# EAGLE design Version_2 (EAGLE 6.4)
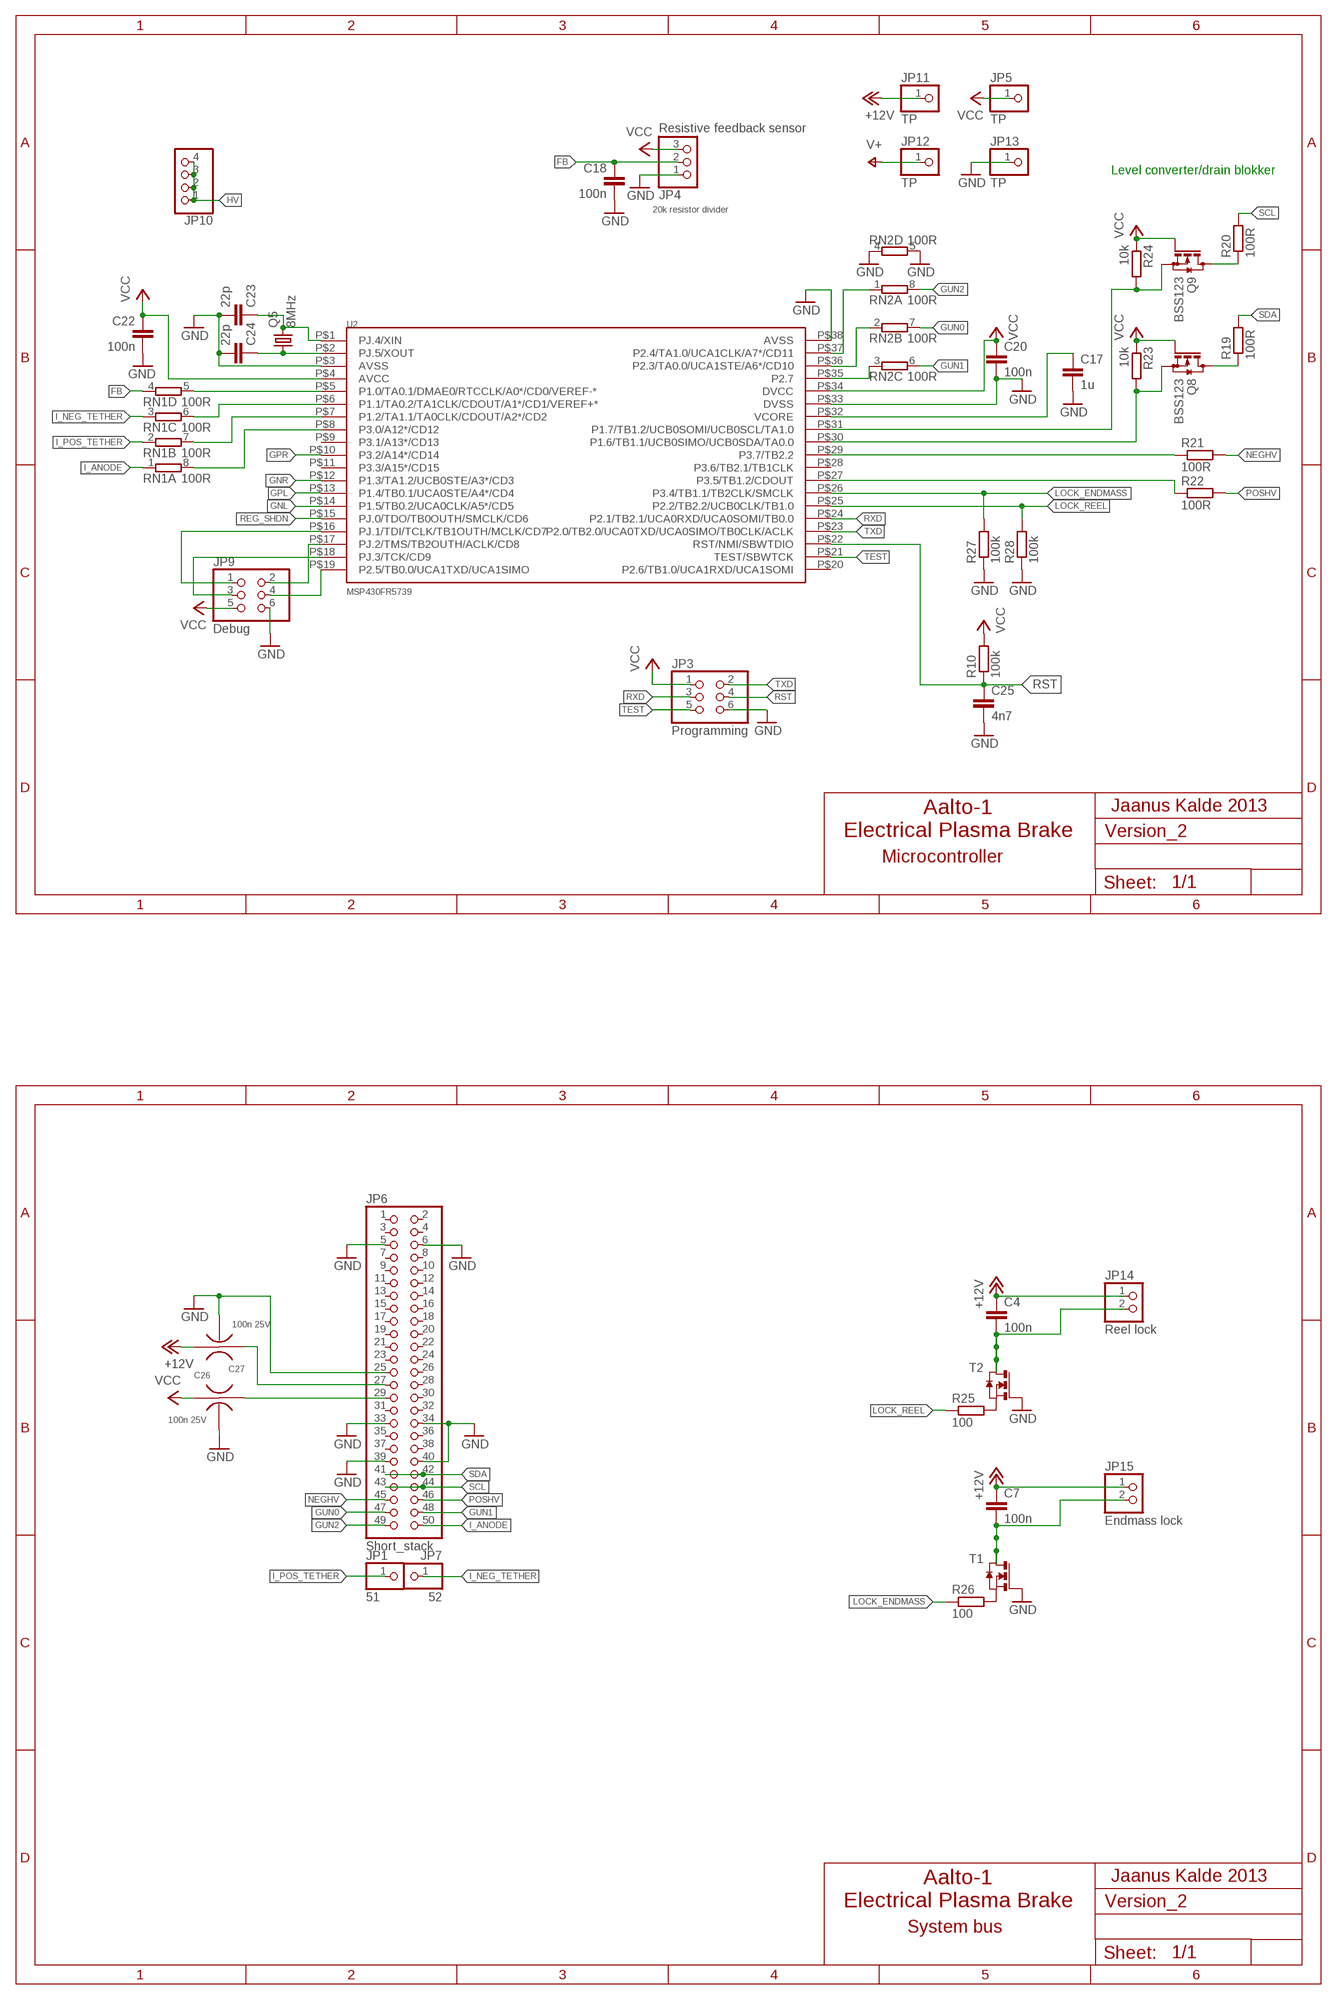
[diagram p0: schematic, sheet 1, part 1 of 2]
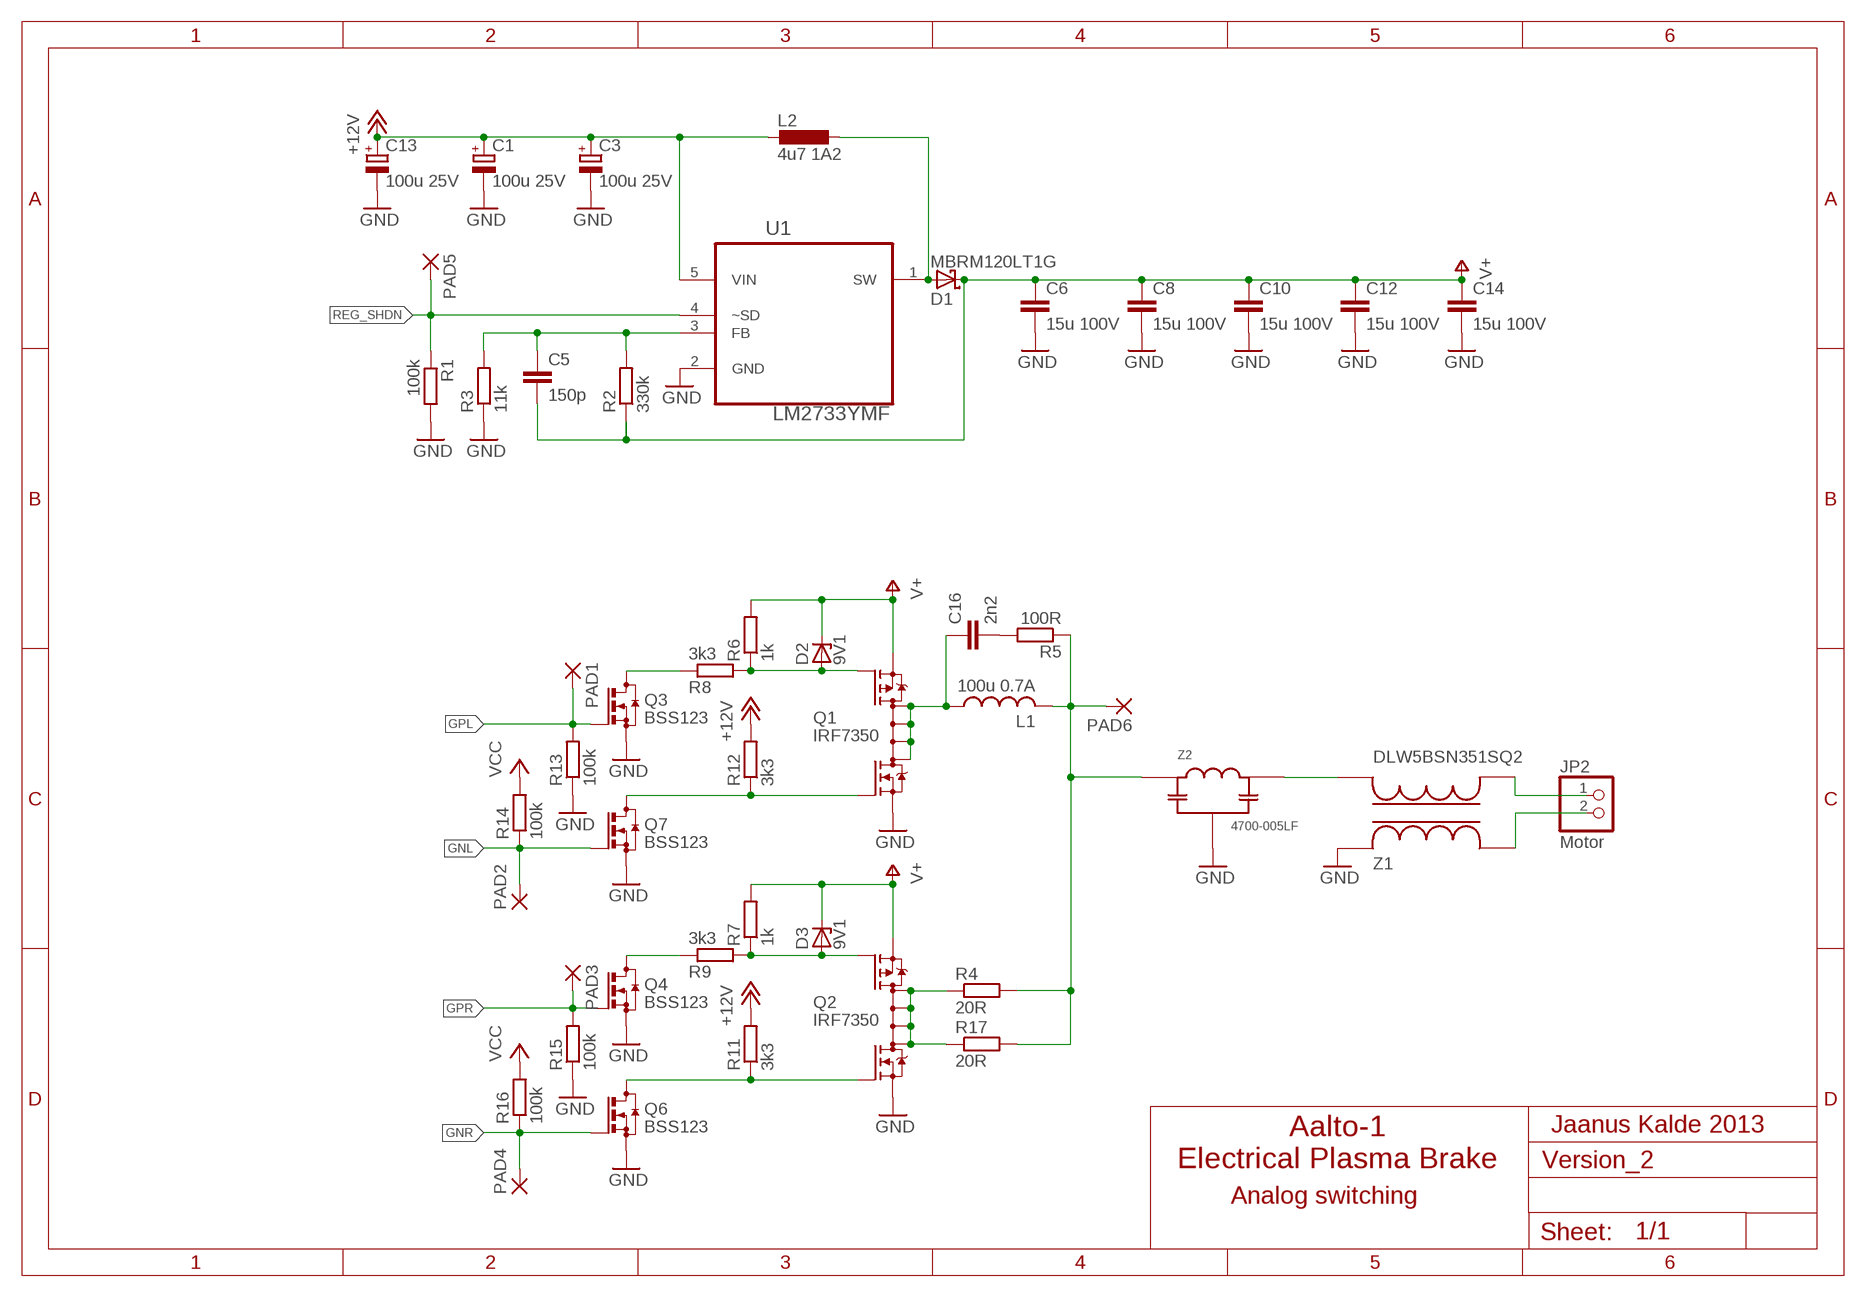
[diagram p1: schematic, sheet 1, part 2 of 2]

## Parts
C1  100u 25V  CPOL-EUSMCE  [SMC_E]
C3  100u 25V  CPOL-EUSMCE  [SMC_E]
C4  100n  C-EUC0603  [C0603]
C5  150p  C-EUC0603K  [C0603K]
C6  15u 100V  C-EUC2220K  [C2220K]
C7  100n  C-EUC0603  [C0603]
C8  15u 100V  C-EUC2220K  [C2220K]
C10  15u 100V  C-EUC2220K  [C2220K]
C12  15u 100V  C-EUC2220K  [C2220K]
C13  100u 25V  CPOL-EUSMCE  [SMC_E]
C14  15u 100V  C-EUC2220K  [C2220K]
C16  2n2  C-EUC0805  [C0805]
C17  1u  C-EUC0603K  [C0603K]
C18  100n  C-EUC0603K  [C0603K]
C20  100n  C-EUC0603K  [C0603K]
C22  100n  C-EUC0603  [C0603]
C23  22p  C-EUC0603  [C0603]
C24  22p  C-EUC0603  [C0603]
C25  4n7  C-EUC0603  [C0603]
C26  100n 25V  CAP-3TERM  [0805-3TERM]
C27  100n 25V  CAP-3TERM  [0805-3TERM]
D1  MBRM120LT1G  [POWERMITE]
D2  9V1  ZENER-DIODESOD80C  [SOD80C]
D3  9V1  ZENER-DIODESOD80C  [SOD80C]
JP1  51  PINHD-1X1  [1X01]
JP2  Motor  PINHD-1X02_2.00  [1X02M]
JP3  Programming  PINHD-2X03_MICROMATCH  [MICROMATCH-6]
JP4  Resistive feedback sensor  PINHD-1X03_2.00  [1X03M]
JP5  TP  PINHD-1X1  [1X01]
JP6  Short_stack  PINHD-2X25  [2X25]
JP7  52  PINHD-1X1  [1X01]
JP9  Debug  PINHD-2X03_MICROMATCH  [MICROMATCH-6]
JP10  PINHD-1X4  [1X04]
JP11  TP  PINHD-1X1  [1X01]
JP12  TP  PINHD-1X1  [1X01]
JP13  TP  PINHD-1X1  [1X01]
JP14  Reel lock  PINHD-1X02_2.00  [1X02M]
JP15  Endmass lock  PINHD-1X02_2.00  [1X02M]
L1  100u 0.7A  L-SMD-7.3  [L-SMD-7.3]
L2  4u7 1A2  SRR4011  [SRR4011]
PAD1  WIREPAD1,6/0,8  [1,6/0,8]
PAD2  WIREPAD1,6/0,8  [1,6/0,8]
PAD3  WIREPAD1,6/0,8  [1,6/0,8]
PAD4  WIREPAD1,6/0,8  [1,6/0,8]
PAD5  WIREPAD1,6/0,8  [1,6/0,8]
PAD6  WIREPAD1,6/0,8  [1,6/0,8]
Q1  IRF7350  IRF7389  [SO08-IRF]
Q2  IRF7350  IRF7389  [SO08-IRF]
Q3  BSS123  [SOT23]
Q4  BSS123  [SOT23]
Q5  8MHz  CRYSTALHC49UV  [HC49U-V]
Q6  BSS123  [SOT23]
Q7  BSS123  [SOT23]
Q8  BSS123  [SOT23]
Q9  BSS123  [SOT23]
R1  100k  R-EU_R0603  [R0603]
R2  330k  R-EU_R0603  [R0603]
R3  11k  R-EU_R0603  [R0603]
R4  20R  R-EU_R2512  [R2512]
R5  100R  R-EU_R0805  [R0805]
R6  1k  R-EU_R0805  [R0805]
R7  1k  R-EU_R0805  [R0805]
R8  3k3  R-EU_R0805  [R0805]
R9  3k3  R-EU_R0805  [R0805]
R10  100k  R-EU_R0603  [R0603]
R11  3k3  R-EU_R0805  [R0805]
R12  3k3  R-EU_R0805  [R0805]
R13  100k  R-EU_R0603  [R0603]
R14  100k  R-EU_R0603  [R0603]
R15  100k  R-EU_R0603  [R0603]
R16  100k  R-EU_R0603  [R0603]
R17  20R  R-EU_R2512  [R2512]
R19  100R  R-EU_R0603  [R0603]
R20  100R  R-EU_R0603  [R0603]
R21  100R  R-EU_R0603  [R0603]
R22  100R  R-EU_R0603  [R0603]
R23  10k  R-EU_R0603  [R0603]
R24  10k  R-EU_R0603  [R0603]
R25  100  R-EU_R0603  [R0603]
R26  100  R-EU_R0603  [R0603]
R27  100k  R-EU_R0603  [R0603]
R28  100k  R-EU_R0603  [R0603]
RN1  100R  4R-NEXBN8V  [EXBN8V]
RN2  100R  4R-NEXBN8V  [EXBN8V]
T1  NMOSSOT23-6  [SOT23-6]
T2  NMOSSOT23-6  [SOT23-6]
U1  LM2733YMF  [SOT95P284X119-5N]
U2  MSP430FR5739  [TSSOP38]
Z1  DLW5BSN351SQ2  DLW5BS  [DLW5BS]
Z2  4700-005LF  FILTER-PI  [FILTER-PI]

## Nets
+12V: C1.+ C3.+ C4.1 C7.1 C13.+ C26.P$1 JP11.1 JP14.1 JP15.1 L2.P$1 R11.2 R12.2 U1.5(VIN)
CLK: JP9.3 U2.P$18(PJ.3/TCK/CD9)
FB: C18.1 JP4.2 RN1.4
FBBBBBA: C5.1 R2.2 R3.2 U1.3(FB)
GND: C1.- C3.- C6.2 C8.2 C10.2 C12.2 C13.- C14.2 C17.2 C18.2 C20.2 C22.2 C23.2 C24.2 C25.2 C26.P$2 C27.P$2 JP3.6 JP4.1 JP6.5 JP6.6 JP6.25 JP6.33 JP6.34 JP6.39 JP6.40 JP9.6 JP13.1 Q1.1(N-S) Q2.1(N-S) Q3.2(S) Q4.2(S) Q6.2(S) Q7.2(S) R1.2 R3.1 R13.1 R15.1 R27.1 R28.1 RN2.4 RN2.5 T1.4(G) T2.4(G) U1.2(GND) U2.P$3(AVSS) U2.P$33(DVSS) U2.P$38(AVSS) Z1.P$2 Z2.P$2
GNL: PAD2.1(P) Q7.1(G) R14.1 U2.P$14(P1.5/TB0.2/UCA0CLK/A5*/CD5)
GNR: PAD4.1(P) Q6.1(G) R16.1 U2.P$12(P1.3/TA1.2/UCB0STE/A3*/CD3)
GPL: PAD1.1(P) Q3.1(G) R13.2 U2.P$13(P1.4/TB0.1/UCA0STE/A4*/CD4)
GPR: PAD3.1(P) Q4.1(G) R15.2 U2.P$10(P3.2/A14*/CD14)
GUN0: JP6.47 RN2.7
GUN1: JP6.48 RN2.6
GUN2: JP6.49 RN2.8
HV: JP10.1 JP10.2 JP10.3 JP10.4
I_ANODE: JP6.50 RN1.1
I_NEG_TETHER: JP7.1 RN1.3
I_POS_TETHER: JP1.1 RN1.2
LOCK_ENDMASS: R26.1 R27.2 U2.P$26(P3.4/TB1.1/TB2CLK/SMCLK)
LOCK_REEL: R25.1 R28.2 U2.P$25(P2.2/TB2.2/UCB0CLK/TB1.0)
MISO/RX: JP9.2 U2.P$17(PJ.2/TMS/TB2OUTH/ACLK/CD8)
N$1: Q2.2(N-G) Q6.3(D) R11.1
N$2: C7.2 JP15.2 T1.1(D) T1.2(D1) T1.5(D2) T1.6(D3)
N$3: R26.2 T1.3(S)
N$4: C17.1 U2.P$32(VCORE)
N$5: RN1.5 U2.P$5(P1.0/TA0.1/DMAE0/RTCCLK/A0*/CD0/VEREF-*)
N$6: Q1.2(N-G) Q7.3(D) R12.1
N$7: C26.P$3 JP6.27
N$8: D1.2(A) L2.P$2 U1.1(SW)
N$9: C4.2 JP14.2 T2.1(D) T2.2(D1) T2.5(D2) T2.6(D3)
N$10: R25.2 T2.3(S)
N$11: Q9.3(D) R20.1
N$12: Q8.3(D) R19.1
N$14: C16.2 R5.2
N$15: C16.1 L1.P$1 Q1.5(D) Q1.6(D) Q1.7(D) Q1.8(D)
N$16: L1.P$2 PAD6.1(P) R4.2 R5.1 R17.2 Z2.P$1
N$17: Q2.5(D) Q2.6(D) Q2.7(D) Q2.8(D) R4.1 R17.1
N$18: C27.P$1 JP6.29
N$19: Q9.2(S) R24.2 U2.P$31(P1.7/TB1.2/UCB0SOMI/UCB0SCL/TA1.0)
N$20: D2.A Q1.4(P-G) R6.1 R8.2
N$21: Z1.P$3 Z2.P$3
N$22: D3.A Q2.4(P-G) R7.1 R9.2
N$23: JP2.1 Z1.P$4
N$24: Q3.3(D) R8.1
N$25: Q4.3(D) R9.1
N$27: R22.1 U2.P$27(P3.5/TB1.2/CDOUT)
N$28: C23.1 Q5.2 U2.P$1(PJ.4/XIN)
N$29: C24.1 Q5.1 U2.P$2(PJ.5/XOUT)
N$30: RN1.6 U2.P$6(P1.1/TA0.2/TA1CLK/CDOUT/A1*/CD1/VEREF+*)
N$31: RN2.1 U2.P$37(P2.4/TA1.0/UCA1CLK/A7*/CD11)
N$32: R21.1 U2.P$29(P3.7/TB2.2)
N$33: Q8.2(S) R23.2 U2.P$30(P1.6/TB1.1/UCB0SIMO/UCB0SDA/TA0.0)
N$34: RN1.7 U2.P$7(P1.2/TA1.1/TA0CLK/CDOUT/A2*/CD2)
N$35: JP2.2 Z1.P$1
N$36: RN1.8 U2.P$8(P3.0/A12*/CD12)
N$38: RN2.2 U2.P$36(P2.3/TA0.0/UCA1STE/A6*/CD10)
N$39: RN2.3 U2.P$35(P2.7)
N$41: JP9.1 U2.P$16(PJ.1/TDI/TCLK/TB1OUTH/MCLK/CD7)
NEGHV: JP6.45 R21.2
POSHV: JP6.46 R22.2
REG_SHDN: PAD5.1(P) R1.1 U1.4(~SD) U2.P$15(PJ.0/TDO/TB0OUTH/SMCLK/CD6)
RST: C25.1 JP3.4 R10.1 U2.P$22(RST/NMI/SBWTDIO)
RXD: JP3.3 U2.P$24(P2.1/TB2.1/UCA0RXD/UCA0SOMI/TB0.0)
SCL: JP6.43 JP6.44 R20.2
SDA: JP6.41 JP6.42 R19.2
SLAVE: JP9.4 U2.P$19(P2.5/TB0.0/UCA1TXD/UCA1SIMO)
TEST: JP3.5 U2.P$21(TEST/SBWTCK)
TXD: JP3.2 U2.P$23(P2.0/TB2.0/UCA0TXD/UCA0SIMO/TB0CLK/ACLK)
V+: C5.2 C6.1 C8.1 C10.1 C12.1 C14.1 D1.1(C) D2.C D3.C JP12.1 Q1.3(P-S) Q2.3(P-S) R2.1 R6.2 R7.2
VCC: C20.1 C22.1 C27.P$3 JP3.1 JP4.3 JP5.1 JP9.5 Q8.1(G) Q9.1(G) R10.2 R14.2 R16.2 R23.1 R24.1 U2.P$4(AVCC) U2.P$34(DVCC)
Unconnected: JP6.1 JP6.2 JP6.3 JP6.4 JP6.7 JP6.8 JP6.9 JP6.10 JP6.11 JP6.12 JP6.13 JP6.14 JP6.15 JP6.16 JP6.17 JP6.18 JP6.19 JP6.20 JP6.21 JP6.22 JP6.23 JP6.24 JP6.26 JP6.28 JP6.30 JP6.31 JP6.32 JP6.35 JP6.36 JP6.37 JP6.38 U2.P$9(P3.1/A13*/CD13) U2.P$11(P3.3/A15*/CD15) U2.P$20(P2.6/TB1.0/UCA1RXD/UCA1SOMI) U2.P$28(P3.6/TB2.1/TB1CLK)

## Notes on the sheet
- Level converter/drain blokker
- 20k resistor divider
- Jaanus Kalde 2013 | Jaanus Kalde 2013
- Aalto-1
  Electrical Plasma Brake
- Aalto-1
  Electrical Plasma Brake
- Microcontroller | Analog switching
- Jaanus Kalde 2013
- Aalto-1
  Electrical Plasma Brake
- System bus

## Library data of the parts
C1 C3 C13 = rcl:CPOL-EU: POLARIZED CAPACITOR, European symbol
C4-C8 C10 C12 C14 C16-C18 C20 C22-C25 = rcl:C-EU: CAPACITOR, European symbol
C26 C27 = EC1_PL_MOTOR:CAP-3TERM
D1 = EC1_B_EPS_PARTS:MBRM120LT1G: Low capacitance Schottky diode. Recommeended in LTC3440 application.
D2 D3 = diode:ZENER-DIODE: Z-Diode
JP1 JP5 JP7 JP11-JP13 = pinhead:PINHD-1X1: PIN HEADER
JP2 JP14 JP15 = pinhead:PINHD-1X02: PIN HEADER
JP3 JP9 = pinhead:PINHD-2X03: PIN HEADER
JP4 = pinhead:PINHD-1X03: PIN HEADER
JP6 = pinhead:PINHD-2X25: PIN HEADER
JP10 = pinhead:PINHD-1X4: PIN HEADER
L1 = EC1_B_EPS_PARTS:L-SMD-7.3
L2 = EC1_PL_MOTOR:SRR4011
PAD1-PAD6 = wirepad:WIREPAD: Wire PAD connect wire on PCB
Q1 Q2 = transistor-fet:IRF7389: Complimentary Half Bridge HEXFET Power MOSFET Source: http://www.irf.com/product-info/datasheets/data/irf7389.pdf
Q3 Q4 Q6-Q9 = transistor-small-signal:BSS123: N-CHANNEL MOS FET
Q5 = SparkFun:CRYSTAL: Crystals Various standard crystals. Proven footprints. Spark Fun Electronics SKU : COM-00534
R1-R17 R19-R28 = rcl:R-EU_: RESISTOR, European symbol
RN1 RN2 = resistor-dil:4R-N: Array Chip Resistor Source: RS Component / Phycomp; OC_FARNELL: unknown; OC_NEWARK: unknown
T1 T2 = zetex:NMOSSOT23-6: MOS FET; OC_FARNELL: unknown; OC_NEWARK: unknown
U1 = national-semiconductor:LM2733YMF: Boost Converters; MPN: LM2733YMF; OC_FARNELL: 8181675; OC_NEWARK: 26H4075; PACKAGE: SOT-23-5; SUPPLIER: NationalSemiconductor
U2 = EC1_PL_MOTOR:MSP430FR5739
Z1 = EC1_PL_MOTOR:DLW5BS
Z2 = EC1_PL_MOTOR:FILTER-PI

## Board
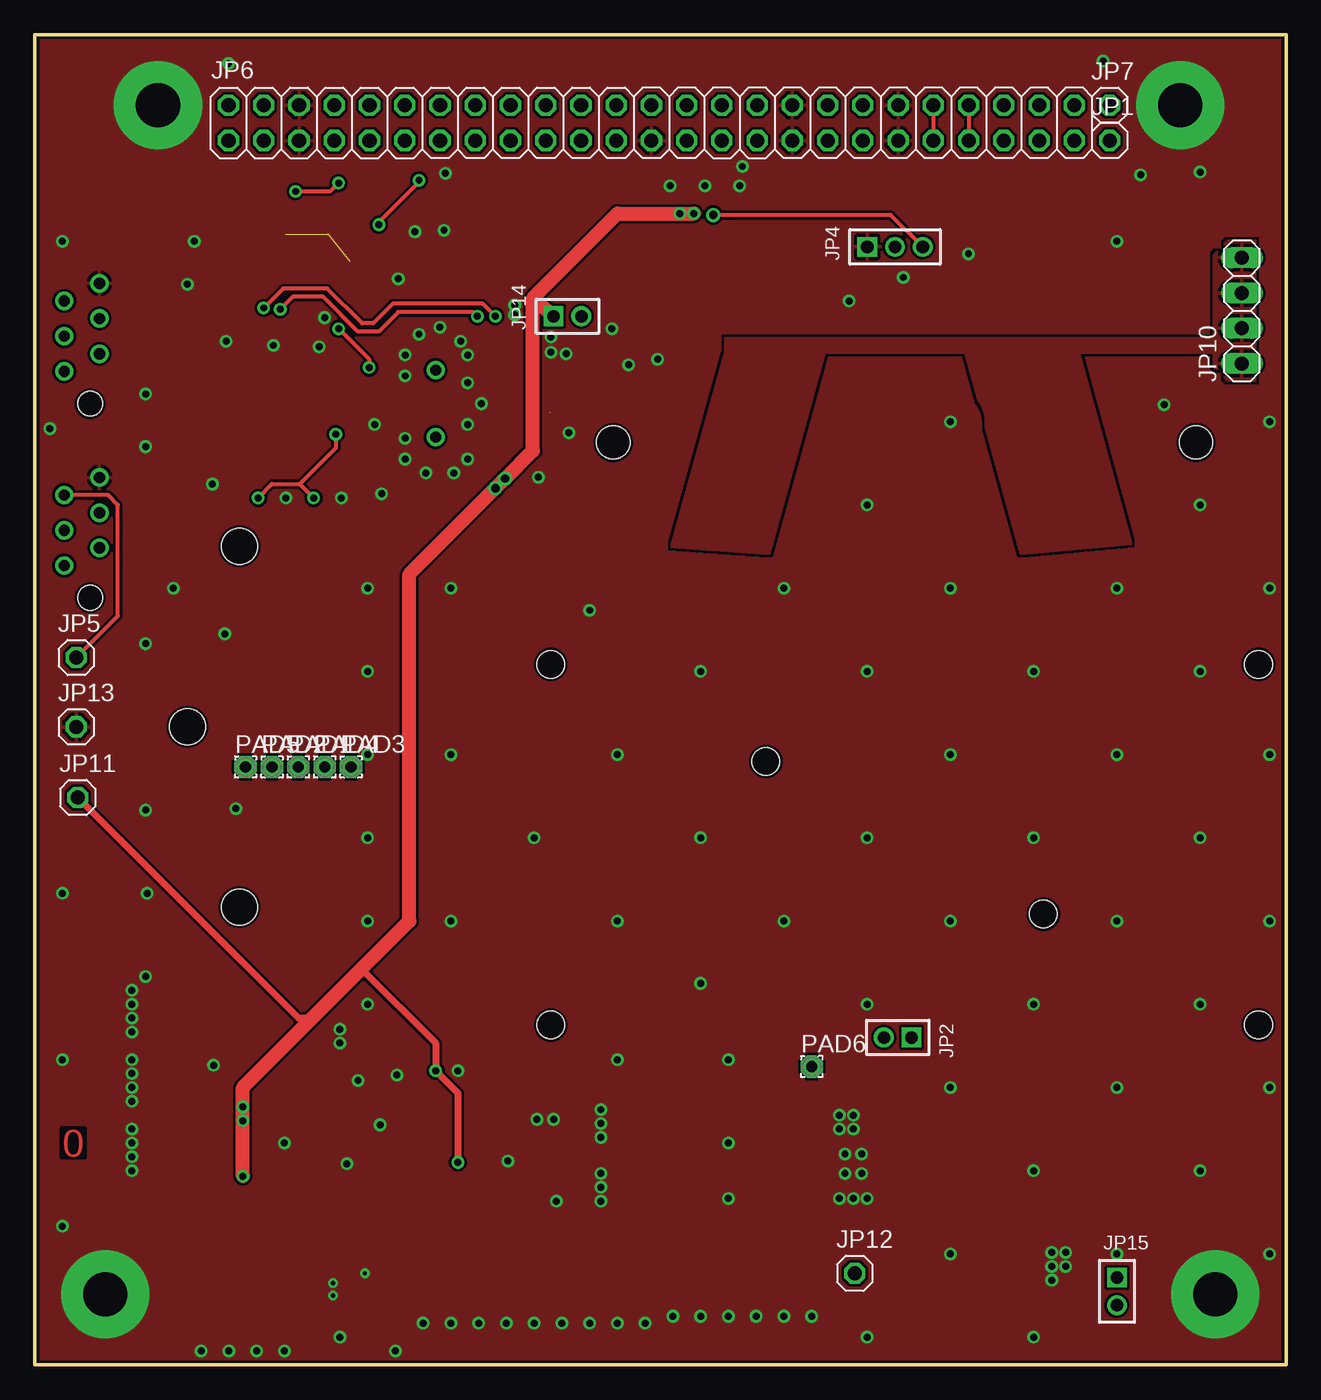
[diagram p2: board, top side]
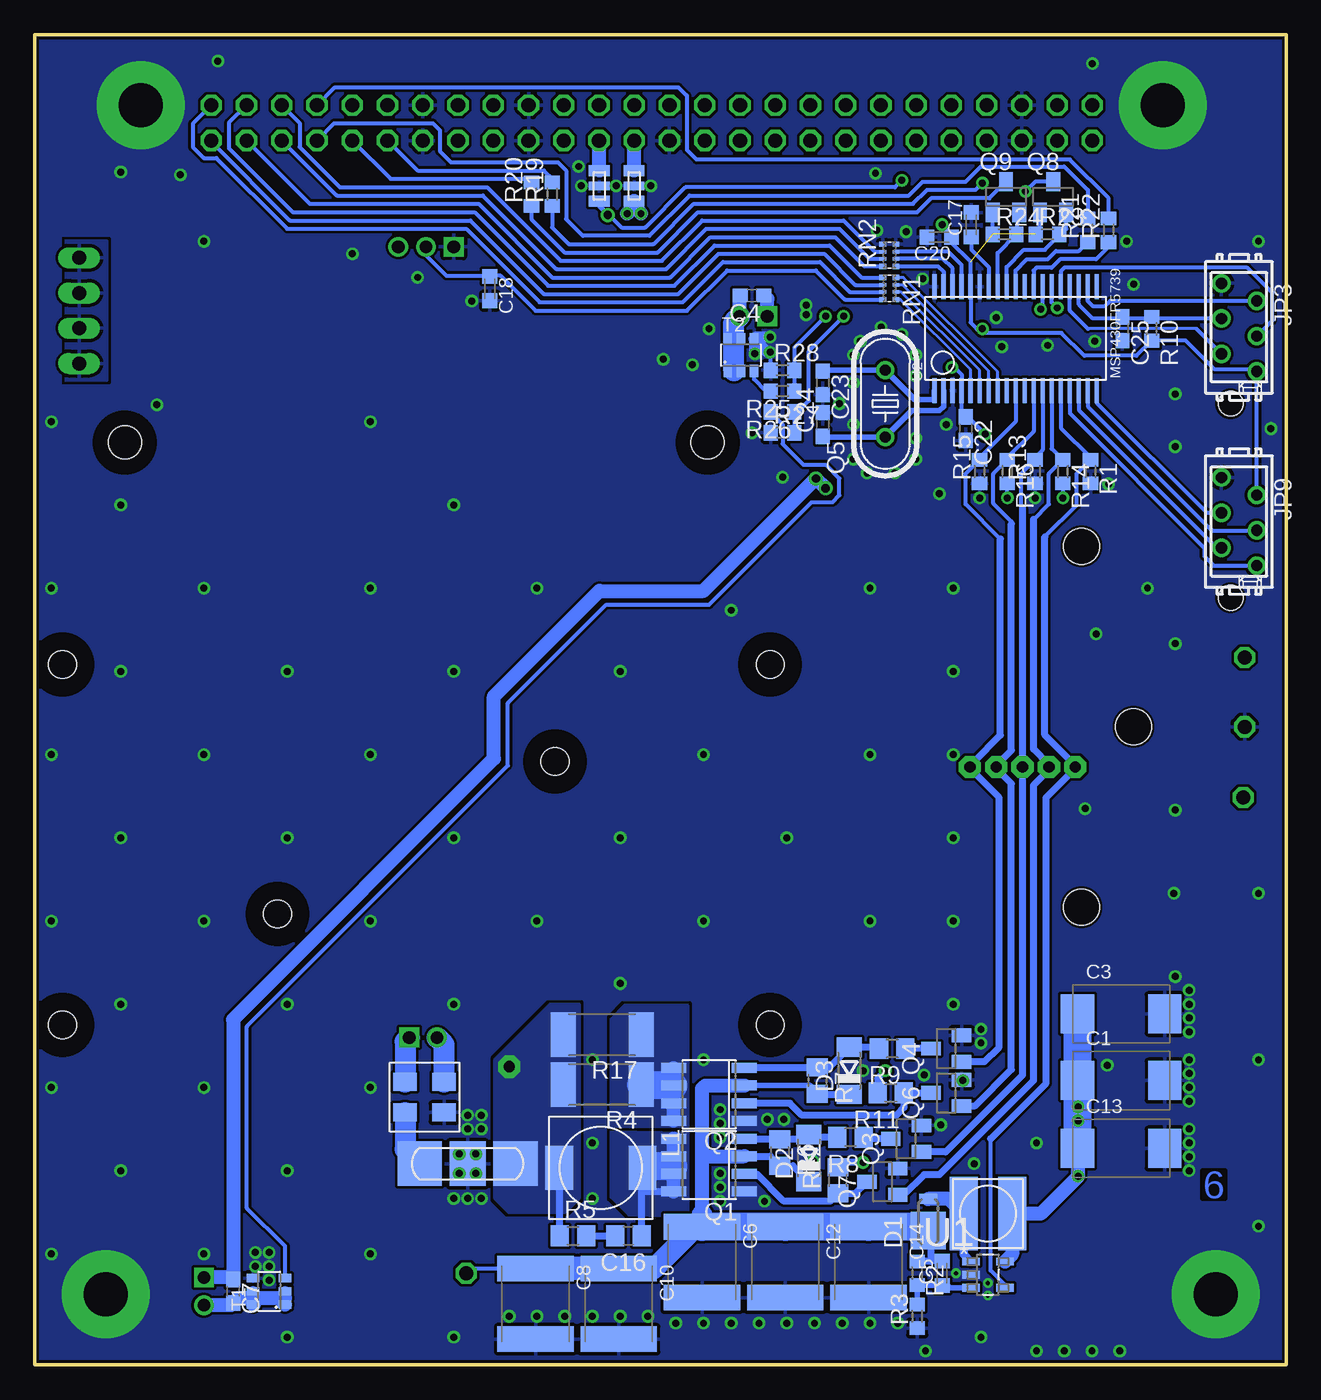
[diagram p3: board, bottom side, seen from below]

Size 90.2 x 95.9 mm. Coordinates in mm from the lower left corner, seen from the top.
Outline: 0,0 90.2,0 90.2,95.9 0,95.9 0,0
Copper layers (1*16): Top 0.035mm / dielectric 0.3mm / Bottom 0.035mm
Design rules "brandner_6layers *": minimum track width 0.05mm, minimum drill 0.1mm, track to track 0.19mm, track to pad 0.19mm, pad to pad 0.19mm, via to via 0.19mm, smd to smd 0mil, copper to edge 0.2mm, drill to drill 0.15mm, minimum pad ring 10mil, minimum via ring 8mil, stop-mask expansion 0.05mm, vias tented up to drill 0.8mm, thermal gap 10mil
Holes 1.8 mm at 4,69.3 4,55.3
Holes 2.4 mm at 83.7,66.5 41.7,66.5
Holes 2 mm at 88.2,50.5 88.2,24.5 37.2,50.5 37.2,24.5 52.7,43.5 72.7,32.5
Holes 2.6 mm at 14.75,33 11,46 14.75,59
bKeepout: area 35.2,22.5 to 39.2,26.5; area 39.7,64.5 to 43.7,68.5; area 81.7,64.5 to 85.7,68.5
bRestrict: area 35.2,22.5 to 39.2,26.5; area 35.2,48.5 to 39.2,52.5; area 50.7,41.5 to 54.7,45.5; area 70.7,30.5 to 74.7,34.5; area 86.2,22.5 to 90.2,26.5; area 86.2,48.5 to 90.2,52.5; area 81.7,64.5 to 85.7,68.5; area 39.7,64.5 to 43.7,68.5

### Footprints (pad centres in the part's own frame; a part is rotated, then mirrored left to right if it is on the bottom)
SMC_E = smd 2.4 x 2.8: + -3.15,0; - 3.15,0
C0603 = smd 1.1 x 1: 1 -0.85,0; 2 0.85,0
C0603K = smd 1.05 x 1.08: 1 -0.875,0; 2 0.875,0
C2220K = smd 1.85 x 5.5: 1 -2.55,0; 2 2.55,0
C0805 = smd 1.3 x 1.5: 1 -0.95,0; 2 0.95,0
0805-3TERM = smd 0.8 x 1.5: P$1 -1.1,0; P$3 1.1,0 | smd 0.6 x 1.5: P$2 0,0
POWERMITE = smd 2.7 x 2.5: 1 -0.635,0 | smd 0.7 x 1.3: 2 1.665,0
SOD80C = smd 1.4 x 1.8: A 1.7,0; C -1.7,0
1X01 = drill 1.016 octagon: 1 0,0
1X02M = drill 0.914 square: 1 -1,0 | drill 0.914: 2 1,0
MICROMATCH-6 = drill 0.813: 1 3.175,1.27; 2 1.905,-1.27; 3 0.635,1.27; 4 -0.635,-1.27; 5 -1.905,1.27; 6 -3.175,-1.27
1X03M = drill 0.914 square: 1 -2,0 | drill 0.914: 2 0,0; 3 2,0
2X25 = drill 1.016 octagon: 1 -30.48,-1.27; 2 -30.48,1.27; 3 -27.94,-1.27; 4 -27.94,1.27; 5 -25.4,-1.27; 6 -25.4,1.27; 7 -22.86,-1.27; 8 -22.86,1.27; 9 -20.32,-1.27; 10 -20.32,1.27; 11 -17.78,-1.27; 12 -17.78,1.27; 13 -15.24,-1.27; 14 -15.24,1.27; 15 -12.7,-1.27; 16 -12.7,1.27; 17 -10.16,-1.27; 18 -10.16,1.27; 19 -7.62,-1.27; 20 -7.62,1.27; 21 -5.08,-1.27; 22 -5.08,1.27; 23 -2.54,-1.27; 24 -2.54,1.27; 25 0,-1.27; 26 0,1.27; 27 2.54,-1.27; 28 2.54,1.27; 29 5.08,-1.27; 30 5.08,1.27; 31 7.62,-1.27; 32 7.62,1.27; 33 10.16,-1.27; 34 10.16,1.27; 35 12.7,-1.27; 36 12.7,1.27; 37 15.24,-1.27; 38 15.24,1.27; 39 17.78,-1.27; 40 17.78,1.27; 41 20.32,-1.27; 42 20.32,1.27; 43 22.86,-1.27; 44 22.86,1.27; 45 25.4,-1.27; 46 25.4,1.27; 47 27.94,-1.27; 48 27.94,1.27; 49 30.48,-1.27; 50 30.48,1.27
1X04 = drill 1.016 long: 1 -3.81,0; 2 -1.27,0; 3 1.27,0; 4 3.81,0
L-SMD-7.3 = smd 3.2 x 2: P$1 0,3; P$2 0,-3
SRR4011 = smd 2 x 5.3: P$1 -1.75,0; P$2 1.75,0
1,6/0,8 = drill 0.813 pad 1.6 octagon: 1 0,0
SO08-IRF = smd 0.72 x 1.78: 1 -1.905,-2.543; 2 -0.635,-2.543; 3 0.635,-2.543; 4 1.905,-2.543; 5 1.905,2.543; 6 0.635,2.543; 7 -0.635,2.543; 8 -1.905,2.543
SOT23 = smd 1 x 1.4: 1 -0.95,-1.1; 2 0.95,-1.1; 3 0,1.1
HC49U-V = drill 0.813: 1 -2.413,0; 2 2.413,0
R0603 = smd 1 x 1.1: 1 -0.85,0; 2 0.85,0
R2512 = smd 1.8 x 3.2: 1 -2.8,0; 2 2.8,0
R0805 = smd 1.3 x 1.5: 1 -0.95,0; 2 0.95,0
EXBN8V = smd 0.38 x 0.5: 1 -0.8,-0.475; 4 0.8,-0.475; 5 0.8,0.475; 8 -0.8,0.475 | smd 0.25 x 0.5: 2 -0.25,-0.475; 3 0.25,-0.475; 6 0.25,0.475; 7 -0.25,0.475
SOT23-6 = smd 0.6 x 0.9: 1 -0.95,-1.15; 2 0,-1.15; 3 0.95,-1.15; 4 0.95,1.15; 5 0,1.15; 6 -0.95,1.15
SOT95P284X119-5N = smd 1.27 x 0.559: 1 -1.219,0.94; 2 -1.219,0; 3 -1.219,-0.94; 4 1.219,-0.94; 5 1.219,0.94
TSSOP38 = smd 1.8 x 0.3: P$1 -3.75,5.85; P$2 -3.75,5.2; P$3 -3.75,4.55; P$4 -3.75,3.9; P$5 -3.75,3.25; P$6 -3.75,2.6; P$7 -3.75,1.95; P$8 -3.75,1.3; P$9 -3.75,0.65; P$10 -3.75,0; P$11 -3.75,-0.65; P$12 -3.75,-1.3; P$13 -3.75,-1.95; P$14 -3.75,-2.6; P$15 -3.75,-3.25; P$16 -3.75,-3.9; P$17 -3.75,-4.55; P$18 -3.75,-5.2; P$19 -3.75,-5.85; P$20 3.75,-5.85; P$21 3.75,-5.2; P$22 3.75,-4.55; P$23 3.75,-3.9; P$24 3.75,-3.25; P$25 3.75,-2.6; P$26 3.75,-1.95; P$27 3.75,-1.3; P$28 3.75,-0.65; P$29 3.75,0; P$30 3.75,0.65; P$31 3.75,1.3; P$32 3.75,1.95; P$33 3.75,2.6; P$34 3.75,3.25; P$35 3.75,3.9; P$36 3.75,4.55; P$37 3.75,5.2; P$38 3.75,5.85
DLW5BS = smd 1.3 x 1.7: P$1 -1.1,1.4; P$2 1.1,1.4; P$3 1.1,-1.4; P$4 -1.1,-1.4
FILTER-PI = smd 3.2 x 3.2: P$1 -3.45,0; P$3 3.45,0 | smd 2.6 x 3.2: P$2 0,0

### Placement (x,y rotation side)
C1  11.9,20.5 0 bottom
C3  11.9,25.3 0 bottom
C4  38.5,77.1 180 bottom
C5  24.8,6.6 90 bottom
C6  42.1,7.4 270 bottom
C7  75.9,5.3 270 bottom
C8  54.1,4.4 270 bottom
C10  48.1,4.4 270 bottom
C12  36.1,7.4 270 bottom
C13  11.9,15.6 0 bottom
C14  30.1,7.4 270 bottom
C16  47.4,9.3 180 bottom
C17  22.7,82.2 90 bottom
C18  57.4,77.6 270 bottom
C20  25,81.3 180 bottom
C22  23.1,67.5 270 bottom
C23  33.4,70.8 270 bottom
C24  33.4,67.8 90 bottom
C25  11.8,74.7 270 bottom
C26  47,85 90 bottom
C27  49.5,85 270 bottom
D1  25.8,10.3 90 bottom
D2  34.4,14.9 90 bottom
D3  31.5,21.2 90 bottom
JP1  77.47,88.27 0 top
JP2  62.2,23.6 180 top
JP3  3.4,74.8 270 bottom
JP4  62,80.6 0 top
JP5  3,51 0 top
JP6  44.45,89.54 0 top
JP7  77.47,90.81 0 top
JP9  3.4,60.8 270 bottom
JP10  87,76 90 top
JP11  3.1,40.9 0 top
JP12  59.1,6.6 0 top
JP13  3,46 0 top
JP14  38.4,75.6 0 top
JP15  78,5.3 270 top
L1  49.4,14.2 270 bottom
L2  21.5,10.9 180 bottom
PAD1  19,43.1 0 top
PAD2  17.1,43.1 0 top
PAD3  22.8,43.1 0 top
PAD4  20.9,43.1 0 top
PAD5  15.2,43.1 0 top
PAD6  56,21.5 0 top
Q1  41.6,14.4 90 bottom
Q2  41.6,19.5 90 bottom
Q3  27.4,16.3 90 bottom
Q4  24.5,22.8 90 bottom
Q5  28.9,69.3 90 bottom
Q6  24.5,19.6 90 bottom
Q7  29.1,13.2 90 bottom
Q8  16.8,84.2 0 bottom
Q9  20.2,84.2 0 bottom
R1  14.1,64.4 270 bottom
R2  26.6,6.6 270 bottom
R3  26.6,3.5 90 bottom
R4  49.3,20.2 180 bottom
R5  51.4,9.3 0 bottom
R6  36.5,15.3 270 bottom
R7  33.8,20.5 270 bottom
R8  31.4,16.4 180 bottom
R9  28.4,22.8 180 bottom
R10  9.7,74.7 270 bottom
R11  28.5,19.6 180 bottom
R12  32.3,13.3 90 bottom
R13  18.1,64.4 90 bottom
R14  16.1,64.4 270 bottom
R15  22.1,64.4 90 bottom
R16  20.1,64.4 270 bottom
R17  49.3,23.8 180 bottom
R19  52.9,84.4 90 bottom
R20  54.4,84.4 90 bottom
R21  14.3,81.8 90 bottom
R22  12.8,81.8 90 bottom
R23  17.2,81.5 0 bottom
R24  20.3,81.5 0 bottom
R25  36.3,70.2 180 bottom
R26  36.3,68.7 180 bottom
R27  36.3,67.2 0 bottom
R28  36.3,71.7 0 bottom
RN1  28.6,77.6 270 bottom
RN2  28.6,80 90 bottom
T1  73.3,5.3 90 bottom
T2  39.3,72.8 0 bottom
U1  21.5,6.5 0 bottom
U2  19.5,74 90 bottom
Z1  62.1,19.3 270 bottom
Z2  59,14.5 180 bottom

### Tracks (layer width: path | path; a pad name or v marks a point on that pad's centre or on a via)
+12V  (via drill 0.5, 0.5 pad 0.5, 0.6)
  Top 0.5: v30.5,14.6 30.5,19.6 v28.9,21.2 28.9,23.2 23.55,28.55 | JP11.1 19,25 20,25
  Top 1: 35.9,76.9 35.9,65.9 v33.9,63.9 33.85,63.85 27,57 27,32 23.55,28.55 20,25 15,20 v15,13.6 | 35.9,76.9 42,83 v47.5,83 | 35.9,76.9 JP14.1
  Bottom 0.5: R12.2 31.95,14.6 v30.5,14.6 | v28.9,21.2 29.45,20.65 R11.2
  Bottom 1: U1.5 19.75,7.97 L2.P$1 | 19.55,10.7 L2.P$1 | v15,17.6 v15,18.6 15,20.45 C1.+ | v15,17.6 v15,13.6 17.7,10.9 L2.P$1 | 47,83.5 v46.5,83 | v47.5,83 47,83.5 | 47,83.5 C26.P$1 | C13.+ 15,15.65 v15,17.6 | JP15.1 76.05,6.3 C7.1 75.9,24.9 57.1,43.7 57.1,48.2 49.5,55.8 42,55.8 v33.9,63.9 v33.2,63.2 | JP14.1 37.4,76.85 C4.1
  Bottom 2: C3.+ C13.+
CLK
  Bottom 0.3: U2.P$18 14.3,69.1 5.37,60.16 JP9.3
FB
  Bottom 0.3: JP4.2 62,80 60.52,78.53 57.45,78.53 C18.1 57.35,78.53 56.62,78.53 54.1,76 43.2,76 40.3,78.9 33.9,78.9 31.8,76.8 RN1.4
FBBBBBA
  Bottom 0.4: C5.1 24.82,5.75 R2.2
  Bottom 0.406: U1.3 24.31,5.56 | R2.2 R3.2
  Bottom 0.5: 24.31,5.56 24.48,5.72 C5.1
GND  (via drill 0.3, 0.5, 3.18 pad 6.35)  (1 unrouted)
  Bottom 0.3: R28.1 37.15,72.75 37.65,73.25
  Bottom 0.8: T2.4 38.35,72.85 v38.3,72.9 | v37.2,73 37.4,73 37.65,73.25 T2.4 | v37.2,74.1 38.2,74.1 T2.4
  other vias: 40.8,18.4 40.8,17.4 40.8,16.4 40.8,13.8 40.8,12.8 40.8,11.8 22,23.2 22,24.2 26.1,20.9 24.9,17.3 27.4,81.7 22.1,62.5 38.5,67.2 32.2,69.3 26.2,78.3 24.5,67.8 20.9,75.5 29.6,85.9 23.8,6.6 21.5,5.9 21.5,5 58,17 59,17 58,18 58,12 59,12 60,12 59,18 11,77.9 37.4,17.7 36.2,17.7 42,3 36,3 40,3 38,3 34,3 32,3 30,3 28,3 26,1 16,1 18,1 44,3 23.3,20.5 14,1 12,1 2,10 7,16 2,22 8,28 2,34 8,40 13.7,52.7 8,52 10,56 8,66.2 1.1,67.5 8,70 2,81 11.5,81 13.97,93.81 22,2 48,3.5 54,3.5 60,2 66,8 72,2 78,8 84,14 89,20 72,14 78,20 84,26 89,32 84,38 89,44 84,50 89,56 84,62 89,68 81.4,69.22 79.7,85.8 67.3,80.1 62.6,78.4 44.9,72.5 60,50 66,68 54,56 60,62 78,56 72,50 66,56 78,44 66,44 72,38 78,32 72,26 66,32 60,38 66,20 60,26 54,32 48,27.5 42,32 48,38 36,38 42,44 48,50 40,54.4 36.3,64 30,56 24,50 30,44 24,38 30,32 24,26 24,44 24,32 24,56 25,62.8 12.9,21.6 14.5,40.1 12.8,63.5 84,86 77,94 78,81 89,8 18,16 34.1,14.7 30.5,21.2 42,22 50,22 50,16 50,12 20.5,73.4 58.4,15.2 59.6,15.2 58.4,13.8 59.6,13.8 37.6,11.8 22.5,14.5 13.8,73.8 31.2,70.8 31.2,67.8 31.2,65.3 26.7,66.8 26.7,65.3 30.2,64.3 28.2,64.3 26.7,71.3 26.7,72.8 31.2,72.8 27.7,74.3 29.2,74.8 30.7,73.8 17.2,73.5 45.8,85 29.5,81.8 48.3,85 50.8,85 58.7,76.7 8.89,90.81 82.55,90.81 5.08,5.08 85.09,5.08 18.1,62.5 51,86.4 74.3,7.1 74.3,8.1 73.3,8.1 73.3,7.1 73.3,6.1 42.8,72.1 41.6,74.7 34.6,76.4 34.6,75.7 7,20 7,21 7,25 7,26 7,15 46,3.5 50,3.5 52,3.5 56,3.5 7,19 7,22 7,24 7,27 7,17 7,14 8.1,34
  pour Bottom (no thermals): 36.6,11.6 36.6,12.2 38.6,14.2 41.6,14.2 41.6,11.2 36.6,11.2
  pour Bottom (no thermals): 33.6,19.6 41.6,19.6 41.6,15.6 33.6,15.6
  pour Bottom (no thermals): 24.4,8.2 20.6,8.2 20.6,4.4 24.4,4.4
  pour Top (rank 4): 90,96 0,96 0,0 90,0
  pour Bottom (rank 4): 90,96 90,0 0,0 0,96
GNL
  Bottom 0.3: U2.P$14 16.9,66.05 R14.1 17.1,64.25 17.1,62.05 18.2,60.95
  Bottom 0.5: Q7.1 27.55,12.25 26.1,13.7 25,13.7 18.2,20.5 18.2,41.8 17.1,42.9 PAD2.1 17.1,43.2 17.1,43.3 18.2,44.4 18.2,60.95
GNR
  Bottom 0.3: U2.P$12 18.2,67.3 20.1,65.4 R16.1 21.1,64.25 21.1,62.1 19.8,60.8 19.8,60.65 | PAD4.1 20.6,43.1
  Bottom 0.5: Q6.1 22.45,18.65 19.8,21.3 19.8,41.9 20.6,42.7 20.6,43.1 20.6,43.5 19.8,44.3 19.8,60.65
GPL
  Bottom 0.3: U2.P$13 17.55,65.95 18.1,65.4 R13.2 19.1,64.25 19.1,61.9 19,61.8
  Bottom 0.5: 19,61.8 19,44.3 PAD1.1 19,20.9 24.55,15.35 Q3.1
GPR
  Bottom 0.3: U2.P$10 19.5,68 22.1,65.4 R15.2 | 22.05,65.25 R15.2 | 20.6,59.55 23.1,62.05 23.1,64.25 R15.2 | PAD3.1 22.5,43.1
  Bottom 0.5: Q4.1 21.75,21.85 20.7,22.9 20.7,40.9 22.5,42.7 22.5,43.1 22.5,43.5 20.6,45.4 20.6,59.55
GUN0
  Bottom 0.3: JP6.47 68.42,84.3 57.9,84.3 52.6,79 44.7,79 41.8,81.9 32.2,81.9 30.05,79.75 RN2.7
GUN1
  Bottom 0.3: JP6.48 71.1,89.52 71.1,87.8 68.2,84.9 57.6,84.9 52.3,79.6 45,79.6 42.1,82.5 31.9,82.5 29.65,80.25 RN2.6
GUN2
  Bottom 0.3: JP6.49 70.36,83.7 58.2,83.7 52.9,78.4 44.4,78.4 41.5,81.3 32.5,81.3 30.4,79.2 RN2.8
HV
  pour Top (isolate 2): 49.8,74 85,74 85,80 86,81 88,81 88,71 86,71 85,72 85,73 75.2,73 79,59.2 71.1,58.5 67.1,73 56.9,73 52.9,58.5 45.9,59 49.8,73
  pour Bottom (isolate 2): 85,81 88,81 88,71 85,71
I_ANODE
  Bottom 0.3: JP6.50 76.2,89.54 76.2,87.7 71.6,83.1 58.5,83.1 53.2,77.8 44.1,77.8 41.2,80.7 32.9,80.7 30.6,78.4 RN1.1
I_NEG_TETHER
  Bottom 0.3: JP7.1 78.8,89.48 78.8,87.8 78,87 77.1,87 72,81.9 59.1,81.9 53.8,76.6 43.5,76.6 40.6,79.5 33.6,79.5 31.45,77.35 RN1.3
I_POS_TETHER
  Bottom 0.3: JP1.1 77.47,88.17 71.8,82.5 58.8,82.5 53.5,77.2 43.8,77.2 40.9,80.1 33.3,80.1 31.05,77.85 RN1.2
LOCK_ENDMASS  (via drill 0.5)
  Top 0.3: v31.9,75.6 31.6,75.9 26.2,75.9 24.8,74.5 23.3,74.5 20.8,77 18.6,77 v17.7,76.1
  Bottom 0.3: v17.7,76.1 17.55,76.25 U2.P$26 | v31.9,75.6 34.4,73.1 34.4,69.5 35.2,68.7 R26.1 R27.2
LOCK_REEL  (via drill 0.5)
  Top 0.3: v33.2,75.6 32.3,76.5 25.8,76.5 24.4,75.1 23.6,75.1 21.1,77.6 17.9,77.6 v16.5,76.2
  Bottom 0.3: v16.5,76.2 16.9,76.6 U2.P$25 | v33.2,75.6 35.45,73.35 R28.2 R25.1
MISO/RX
  Bottom 0.3: U2.P$17 14.95,68.85 5,58.9 JP9.2
N$1
  Bottom 0.5: Q2.2 35.77,18.86 34.9,18 28.1,18 27.55,18.55 R11.1 Q6.3
N$2
  Bottom 0.8: T1.2 72.15,4.8 | T1.5 T1.6
  Bottom 1: 72.15,4.8 72.3,4.8 | 72.3,4.8 74.4,4.8 | 74.4,4.8 75.55,4.8 C7.2 76.05,4.3 JP15.2 | T1.1 72.3,4.5 72.3,4.8 | T1.6 74.4,4.4 74.4,4.8
N$3  (1 unrouted)
  Bottom 0.3: T1.3 72.15,8.55 74.9,11.3 74.9,24.4 56.1,43.2 56.1,47.7 49,54.8 41.6,54.8 34.2,62.2 32.7,62.2 32.2,62.7 32.2,63.9 33.2,64.9 34.8,64.9 36.3,66.4 36.3,67.8 37.15,68.65
N$4
  Bottom 0.3: C17.1 22.7,80.4 21.45,79.15 U2.P$32
N$5
  Bottom 0.2: U2.P$5 22.75,71.75 27.8,76.8 RN1.5
N$6
  Bottom 0.5: Q7.3 31.05,12.35 R12.1 32.85,11.8 36.2,11.8 38.16,13.77 Q1.2
N$7
  Bottom 1: C26.P$3 JP6.27
N$8
  Bottom 0.6: U1.1 23.25,7.97 L2.P$2
  Bottom 1: D1.2 24.32,11.96 L2.P$2
N$9
  Bottom 0.5: T2.2 39.8,71.65 T2.1 | 39.8,73.9 39.85,73.95 T2.6 T2.5
  Bottom 1: JP14.2 39.4,77.05 C4.2
  Bottom 1.5: 39.8,71.65 39.8,73.9 39.8,75.2 JP14.2
N$10
  Bottom 0.3: R25.2 37.5,70.2 38.35,71.05 T2.3
N$11
  Bottom 0.3: R20.1 54.4,82.6 52,80.2 45.3,80.2 42.4,83.1 26.6,83.1 25.6,84.1 21.4,84.1 Q9.3
N$12  (via drill 0.5)
  Top 0.3: v18.8,84.6 21.3,84.6 v21.9,85.2
  Bottom 0.3: R19.1 52.9,82 51.7,80.8 45.6,80.8 42.7,83.7 26.9,83.7 25.9,84.7 22.4,84.7 v21.9,85.2 | Q8.3 18.1,85.3 v18.8,84.6
N$14
  Bottom 0.5: R5.2 C16.2
N$15
  Bottom 0.5: C16.1 46.45,12.49 Q1.8
  Bottom 1: Q1.5 Q1.6 44.14,14.3 Q1.7 Q1.8
  Bottom 2: L1.P$1 46.3,14.3 44.14,14.3
  pour Bottom (no thermals): 43.1,16.7 48.7,16.8 48.7,12.1 47.4,10.8 43.1,10.7
N$16
  Bottom 0.5: L1.P$2 52.35,14.15 R5.1
  pour Bottom (no thermals): 51,26 51,12 52,11 56,11 57,12 57,22 53,26
N$17
  Bottom 1: Q2.8 Q2.7 Q2.6 Q2.5
  Bottom 2: R4.1 46.44,20.14 Q2.6
  pour Bottom (no thermals): 43.1,17.2 43.1,25.9 47.7,25.9 48.7,24.9 48.7,17.2
N$18
  Bottom 1: C27.P$1 49.5,88.24 JP6.29
N$19
  Bottom 0.3: Q9.2 19.35,83 R24.2 | U2.P$31 20.8,80.15 R24.2 | 19.35,81.45 R24.2
N$20
  Bottom 0.5: Q1.4 39,16.25 R6.1 34.75,16.25 D2.A 34.2,16.4 R8.2
N$21
  Bottom 1.5: Z1.P$3 63.5,15.55 Z2.P$3
N$22
  Bottom 0.5: R9.2 29.45,22.9 D3.A 32.95,21.45 R7.1 33.84,21.41 Q2.4
N$23
  Bottom 1.5: JP2.1 63.5,23.3 Z1.P$4
N$24
  Bottom 0.5: R8.1 30.35,16.3 Q3.3
N$25
  Bottom 0.5: Q4.3 R9.1
N$27
  Bottom 0.3: R22.1 12.8,80.6 13.7,79.7 16.3,79.7 16.9,79.1 18,79.1 18.2,78.9 U2.P$27
N$28
  Bottom 0.4: Q5.2 26.79,69.6 25.35,69.6 U2.P$1
  Bottom 0.406: Q5.2 33.34,71.71 C23.1
N$29
  Bottom 0.4: U2.P$2 24.7,69.1 25,68.8 26.99,68.8 Q5.1
  Bottom 0.406: Q5.1 33.34,66.89 C24.1
N$30
  Bottom 0.2: U2.P$6 22.1,71.7 27.75,77.35 RN1.6
N$31
  Bottom 0.3: RN2.1 25.1,79.2 24.7,78.8 U2.P$37
N$32
  Bottom 0.3: U2.P$29 19.5,78.9 18.7,79.7 17.2,79.7 16.6,80.3 14.95,80.3 R21.1
N$33
  Bottom 0.3: Q8.2 15.85,81.9 R23.2 16.45,81.35 17.4,80.4 18.9,80.4 20.15,79.15 U2.P$30
N$34
  Bottom 0.2: U2.P$7 21.45,71.65 27.65,77.85 RN1.7
N$35
  Bottom 1.5: Z1.P$1 60.7,23.1 JP2.2
N$36
  Bottom 0.2: U2.P$8 20.8,71.6 27.6,78.4 RN1.8
N$38
  Bottom 0.3: U2.P$36 24.05,79.05 24.75,79.75 RN2.2
N$39
  Bottom 0.3: U2.P$35 23.4,79.3 24.35,80.25 RN2.3
N$41
  Bottom 0.3: U2.P$16 15.6,68.6 5.9,58.9 5.9,58.3 5.22,57.62 JP9.1
NEGHV
  Bottom 0.3: JP6.45 68.62,89.5 61.5,89.5 61,89 61,87.5 60.2,86.7 52.5,86.7 51.9,86.1 51.9,82.6 50.7,81.4 45.9,81.4 43,84.3 27.2,84.3 26.2,85.3 23.1,85.3 22,86.4 16,86.4 14.3,84.7 R21.2
POSHV
  Bottom 0.3: JP6.46 68.56,92.1 43.8,92.1 43.2,91.5 43.2,87.6 42.5,86.9 15.6,86.9 12.8,84.1 R22.2
REG_SHDN
  Bottom 0.3: U1.4 20.28,5.78 21.3,6.8 21.3,16.3 | U2.P$15 16.25,67.55 14.1,65.4 R1.1 15.1,64.25 15.1,62 17.4,59.7 | PAD5.1 15.3,43.2 15.5,43.2
  Bottom 0.5: 21.3,16.3 17.3,20.3 17.3,40.9 15.5,42.7 15.5,43.2 15.5,43.5 17.4,45.4 17.4,59.7
RST
  Bottom 0.2: 14.9,76.4 14.95,76.45
  Bottom 0.3: JP3.4 9.7,75.44 | 9.7,75.44 11.8,75.44 | 11.8,75.44 13.94,75.44 14.9,76.4 | 14.95,76.45 U2.P$22 | 11.8,75.44 C25.1 | 9.7,75.44 R10.1
RXD
  Bottom 0.2: 16.2,78.9 16.25,78.85
  Bottom 0.3: JP3.3 1,75.3 1,77.3 2.8,79.1 16,79.1 16.2,78.9 | 16.25,78.85 U2.P$24
SCL
  Top 0.3: JP6.44 JP6.43
  Bottom 0.3: JP6.43 64.54,85.5 54.65,85.5 R20.2
SDA
  Top 0.3: JP6.42 JP6.41
  Bottom 0.3: JP6.41 62.6,86.1 53.5,86.1 52.9,85.5 R19.2
SLAVE
  Bottom 0.3: U2.P$19 13.65,69.35 5.74,61.44 JP9.4
TEST
  Bottom 0.3: JP3.5 12.7,76.7 13.1,76.3 13.9,76.3 14.3,76.7 U2.P$21
TXD
  Bottom 0.2: 6.47,74.7 14.3,74.7
  Bottom 0.3: JP3.2 6.47,74.7 | 14.3,74.7 15.6,76 U2.P$23
V+
  Bottom 0.3: JP12.1 58.75,6.95 C8.1 | 49,7 48.95,6.95 C10.1
  Bottom 0.4: Q2.3 34.38,20.14 | C5.2 24.82,7.45 25.6,7.45
  Bottom 0.5: R2.1 25.6,7.45 25.6,9.46 D1.1 | 34.38,20.14 R7.2 33.75,19.5 D3.C | Q1.3 37.19,15.04 R6.2 35.55,14.35 D2.C
  Bottom 1: Q2.3 41.87,20.14 42.1,19.9 42.1,14.9 | Q1.3 41.97,15.04 42.1,14.9 | 42.1,10.8 42.1,14.9
  Bottom 1.5: 45.9,7 49,7 | C10.1 45.55,6.95 42.55,9.95 C6.1 42.1,10.8
  Bottom 1.7: 49,7 49.05,6.95 C8.1
  Bottom 2: D1.1 26.09,9.95 C14.1 C12.1 C6.1
VCC  (via drill 0.5, 0.6)  (2 unrouted)
  Top 0.3: JP4.3 61.7,82.9 v48.9,82.9 | v21.9,74.7 24.1,72.5 v24.1,71.9 | v16.1,62.5 17.1,63.5 19.1,63.5 | 19.1,63.5 v20.1,62.5 | v21.7,67.1 21.7,66.1 19.1,63.5 | JP5.1 6,54 6,62 5.29,62.7 JP9.5 | v24.8,82.2 24.8,82.4 27.7,85.3 v27.7,85.4
  Bottom 0.3: 22,74.4 16.2,74.4 14.55,72.75 10.8,72.75 R10.2 7.25,73.85 5.2,71.8 2.31,71.8 JP3.1 JP9.5 | v48.9,82.9 49.5,83.5 C27.P$3 49.5,83.6 47.9,82 46.2,82 43.3,84.9 28.2,84.9 v27.7,85.4 | 22,74.4 22.75,75.15 U2.P$34 22.75,79.53 24.12,80.9 C20.1 24.12,81.53 v24.8,82.2 | 22,74.4 22,74.6 v21.9,74.7 | v24.1,71.9 23.9,71.9 23.4,71.4 U2.P$4 23.4,68.65 C22.1 22.95,68.35 v21.7,67.1 | R14.2 v16.1,62.5 | v20.1,62.5 R16.2 | R24.1 Q9.1 | R23.1 17.75,81.7 Q8.1

### Text on the board
Top: 0
Bottom: 6
tStop: GND | + | Jaanus 2013 | GND | +
bStop: Prog | Debug | 3,3 V | GND | 12 V | +40V